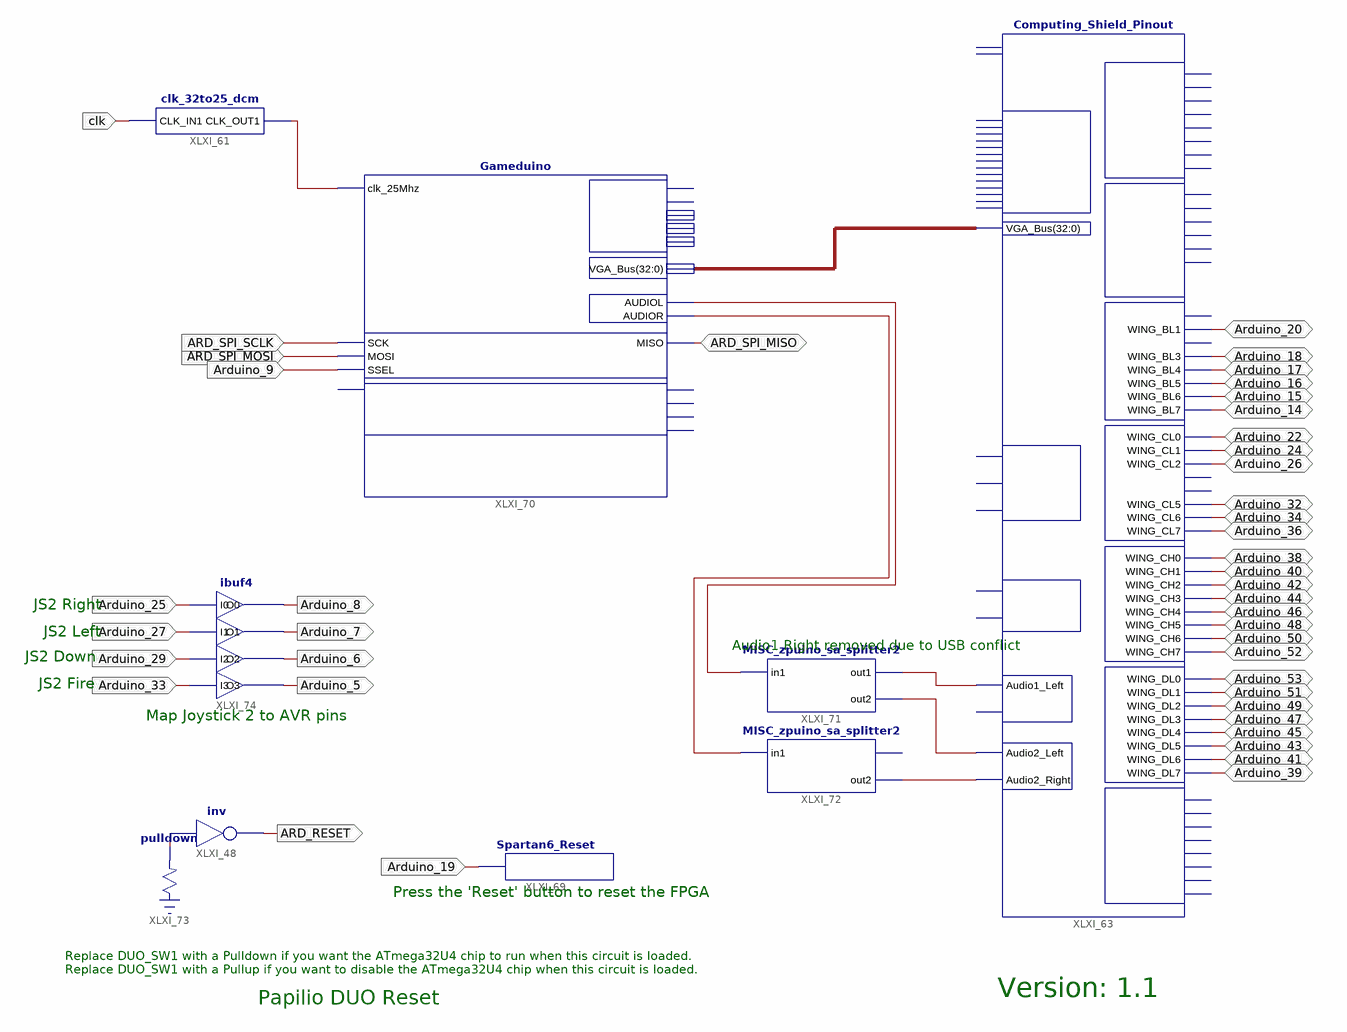
[diagram p0: schematic sheet 1]
// Xilinx ISE schematic Papilio_DUO_LX9.sch (spartan6) as structural Verilog: 9 symbols, 43 ports
module Papilio_DUO_LX9 (
  input  clk,
  input  ARD_SPI_MOSI,
  input  ARD_SPI_SCLK,
  input  Arduino_9,
  input  Arduino_19,
  input  Arduino_25,
  input  Arduino_27,
  input  Arduino_29,
  input  Arduino_33,
  inout  Arduino_20,
  inout  Arduino_18,
  inout  Arduino_17,
  inout  Arduino_16,
  inout  Arduino_15,
  inout  Arduino_14,
  inout  Arduino_22,
  inout  Arduino_24,
  inout  Arduino_26,
  inout  Arduino_32,
  inout  Arduino_34,
  inout  Arduino_36,
  inout  Arduino_38,
  inout  Arduino_40,
  inout  Arduino_42,
  inout  Arduino_44,
  inout  Arduino_46,
  inout  Arduino_48,
  inout  Arduino_50,
  inout  Arduino_52,
  inout  Arduino_53,
  inout  Arduino_51,
  inout  Arduino_49,
  inout  Arduino_47,
  inout  Arduino_45,
  inout  Arduino_43,
  inout  Arduino_41,
  inout  Arduino_39,
  inout  ARD_SPI_MISO,
  output ARD_RESET,
  output Arduino_8,
  output Arduino_7,
  output Arduino_6,
  output Arduino_5
);

  wire XLXN_600, XLXN_737, XLXN_738, XLXN_740, XLXN_742, XLXN_743, XLXN_744;
  wire [32:0] XLXN_717;

  Computing_Shield_Pinout XLXI_63 (
    .Audio1_Left(XLXN_744), .WING_CL0(Arduino_22), .WING_CL1(Arduino_24), .WING_CL2(Arduino_26),
    .WING_CL5(Arduino_32), .WING_CL6(Arduino_34), .WING_CL7(Arduino_36), .WING_CH0(Arduino_38),
    .WING_CH1(Arduino_40), .WING_CH2(Arduino_42), .WING_CH3(Arduino_44), .WING_CH4(Arduino_46),
    .WING_CH5(Arduino_48), .WING_CH6(Arduino_50), .WING_CH7(Arduino_52), .Audio2_Right(XLXN_742),
    .Audio2_Left(XLXN_740), .WING_BL1(Arduino_20), .WING_BL3(Arduino_18), .WING_BL4(Arduino_17),
    .WING_BL5(Arduino_16), .WING_BL6(Arduino_15), .WING_BL7(Arduino_14), .WING_DL0(Arduino_53),
    .WING_DL1(Arduino_51), .WING_DL2(Arduino_49), .WING_DL3(Arduino_47), .WING_DL4(Arduino_45),
    .WING_DL5(Arduino_43), .WING_DL6(Arduino_41), .WING_DL7(Arduino_39), .VGA_Bus(XLXN_717));  // open: gpio_bus_out, gpio_bus_in, WING_AL0, WING_AL1, WING_AL2, WING_AL3, WING_AL4, WING_AL5, WING_AL6, WING_AL7, WING_AH0, WING_AH1, WING_AH2, WING_AH3, WING_AH4, WING_AH5, VGA_Red2, VGA_Red1, VGA_Red0, VGA_Green2, VGA_Green1, VGA_Green0, VGA_Hsync, VGA_Vsync, WING_CL3, WING_CL4, SD_MISO, SD_MOSI, RS232_RX, RS232_TX, SD_SCK, Audio1_Right, WING_BL0, WING_BL2, WING_DH0, WING_DH1, WING_DH2, WING_DH3, WING_DH4, WING_DH5, WING_DH6, WING_DH7, VGA_Red3, VGA_Green3, VGA_Blue3, VGA_Blue1, VGA_Blue0, VGA_Blue2
  clk_32to25_dcm XLXI_61 (.CLK_IN1(clk), .CLK_OUT1(XLXN_600));
  Gameduino XLXI_70 (
    .clk_25Mhz(XLXN_600), .VGA_Bus(XLXN_717), .AUDIOL(XLXN_737), .AUDIOR(XLXN_738), .MISO(ARD_SPI_MISO),
    .MOSI(ARD_SPI_MOSI), .SCK(ARD_SPI_SCLK), .SSEL(Arduino_9));  // open: vga_hsync_n, vga_vsync_n, vga_red, vga_green, vga_blue, flashMISO, flashMOSI, flashSCK, AUX, flashSSEL
  MISC_zpuino_sa_splitter2 XLXI_71 (.in1(XLXN_737), .out1(XLXN_744), .out2(XLXN_740));
  MISC_zpuino_sa_splitter2 XLXI_72 (.in1(XLXN_738), .out2(XLXN_742));  // open: out1
  not XLXI_48 (ARD_RESET, XLXN_743);
  Spartan6_Reset XLXI_69 (.reset(Arduino_19));
  \pulldown  XLXI_73 (.O(XLXN_743));
  ibuf4 XLXI_74 (
    .I0(Arduino_25), .I1(Arduino_27), .I2(Arduino_29), .I3(Arduino_33), .O0(Arduino_8), .O1(Arduino_7),
    .O2(Arduino_6), .O3(Arduino_5));

  // Notes on the sheet:
  //   JS2 Right
  //   JS2 Left
  //   Audio1 Right removed due to USB conflict
  //   JS2 Down
  //   JS2 Fire
  //   Map Joystick 2 to AVR pins
  //   Press the 'Reset' button to reset the FPGA
  //   Replace DUO_SW1 with a Pulldown if you want the ATmega32U4 chip to run when this circuit is loaded.
  //   Replace DUO_SW1 with a Pullup if you want to disable the ATmega32U4 chip when this circuit is loaded.
  //   Version: 1.1
  //   Papilio DUO Reset
endmodule
